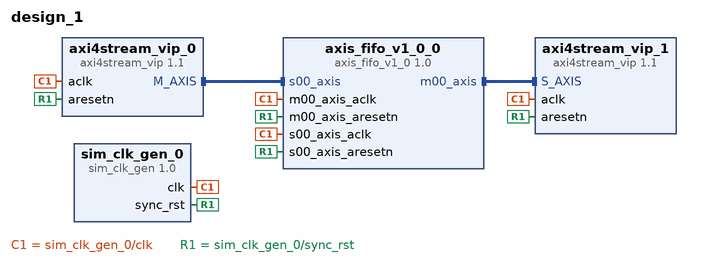
[diagram p0: block diagram of the top level]
# Vivado block design design_1, xc7z020clg400-1, Vivado 2018.3
create_bd_design design_1

create_bd_cell -type ip -vlnv xilinx.com:ip:axi4stream_vip:1.1 axi4stream_vip_0
set_property -dict [list \
  CONFIG.HAS_TKEEP 0 \
  CONFIG.HAS_TLAST 0 \
  CONFIG.HAS_TREADY 1 \
  CONFIG.HAS_TSTRB 0 \
  CONFIG.INTERFACE_MODE MASTER \
  CONFIG.TDATA_NUM_BYTES 1 \
  CONFIG.TDEST_WIDTH 0 \
  CONFIG.TID_WIDTH 0 \
  CONFIG.TUSER_WIDTH 0 \
] [get_bd_cells axi4stream_vip_0]
create_bd_cell -type ip -vlnv xilinx.com:ip:axi4stream_vip:1.1 axi4stream_vip_1
set_property -dict {CONFIG.INTERFACE_MODE SLAVE} [get_bd_cells axi4stream_vip_1]
create_bd_cell -type ip -vlnv xilinx.com:user:axis_fifo_v1_0:1.0 axis_fifo_v1_0_0
create_bd_cell -type ip -vlnv xilinx.com:ip:sim_clk_gen:1.0 sim_clk_gen_0

# ---- connections ----

connect_bd_intf_net [get_bd_intf_pins axi4stream_vip_1/S_AXIS] [get_bd_intf_pins axis_fifo_v1_0_0/m00_axis]
connect_bd_intf_net [get_bd_intf_pins axi4stream_vip_0/M_AXIS] [get_bd_intf_pins axis_fifo_v1_0_0/s00_axis]
connect_bd_net [get_bd_pins sim_clk_gen_0/clk] \
  [get_bd_pins axi4stream_vip_0/aclk] [get_bd_pins axi4stream_vip_1/aclk] [get_bd_pins axis_fifo_v1_0_0/s00_axis_aclk] \
  [get_bd_pins axis_fifo_v1_0_0/m00_axis_aclk]
connect_bd_net [get_bd_pins sim_clk_gen_0/sync_rst] \
  [get_bd_pins axi4stream_vip_0/aresetn] [get_bd_pins axi4stream_vip_1/aresetn] \
  [get_bd_pins axis_fifo_v1_0_0/s00_axis_aresetn] [get_bd_pins axis_fifo_v1_0_0/m00_axis_aresetn]

validate_bd_design
save_bd_design
